# Altium schematic sheet Diagrama.SCHDOC
size A4; PageSetup: Record=PageOptions|CenterHorizontal=True|CenterVertical=True|PrintScale=0.97|XCorrection=1.00|YCorrection=1.00|PrintKind=0|BorderSize=5000000|LeftOffset=0|BottomOffset=0|Orientation=2|PaperLength=1000|PaperWidth=1000|Scale=100|PaperSource=7|PrintQuality=-4|MediaType=1|DitherType=10|PaperKind=A4|PrintScaleMode=1
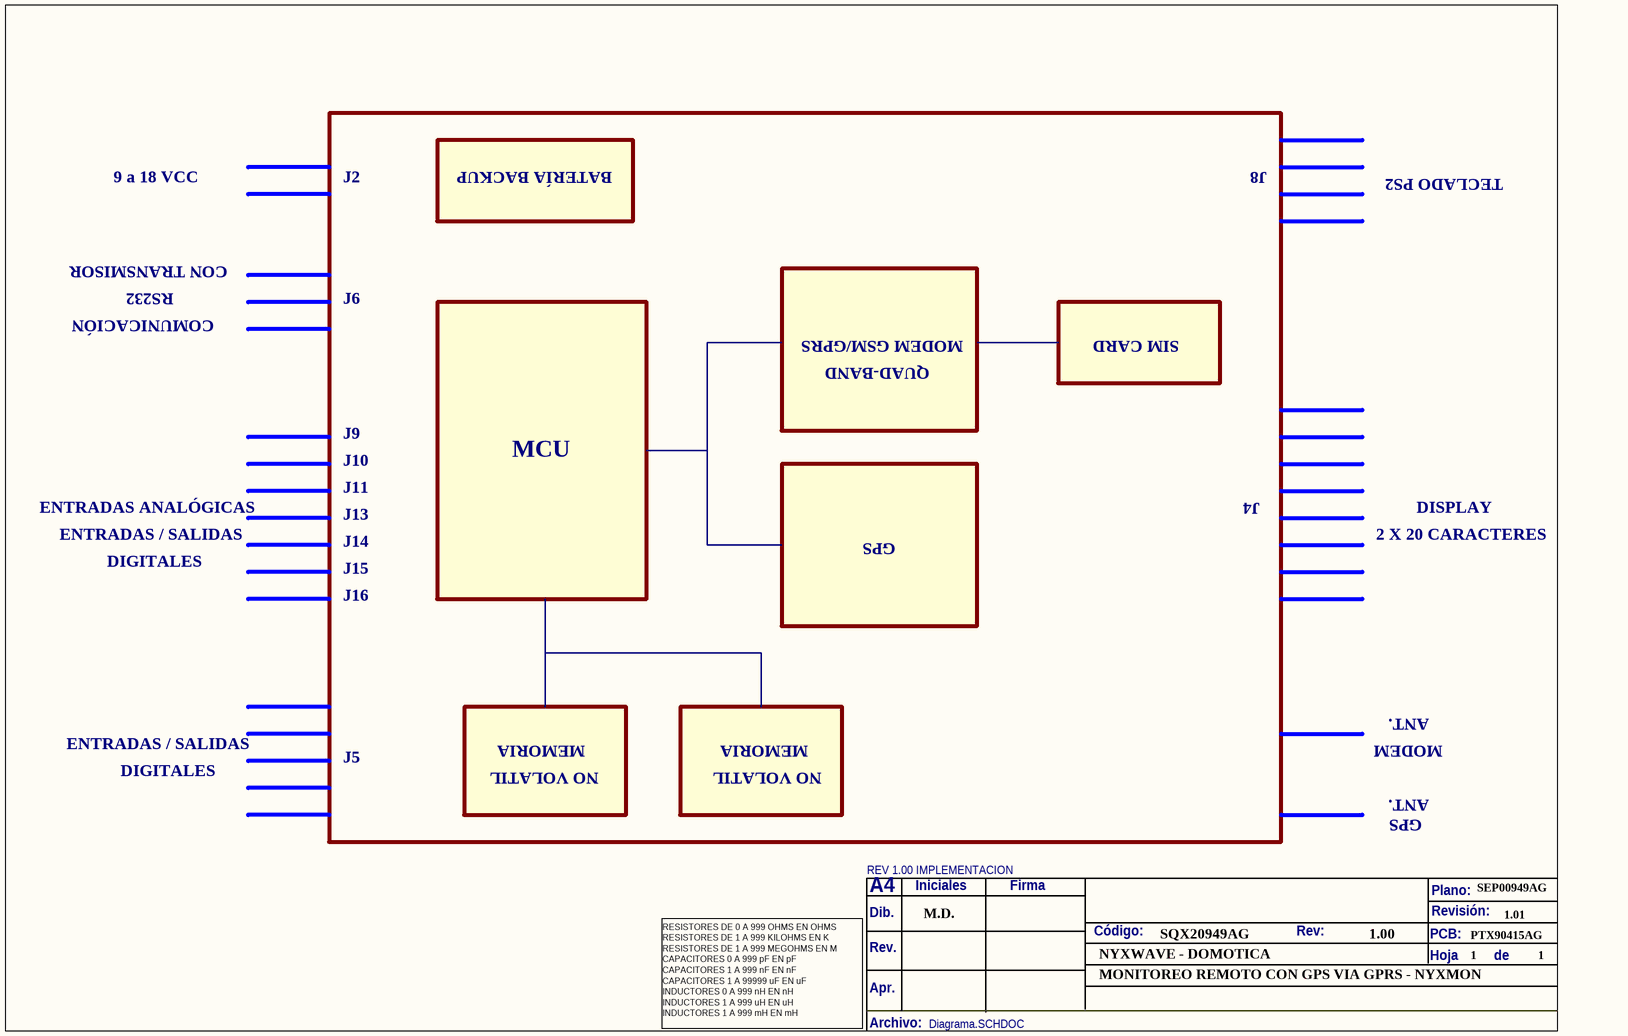
[diagram p0: Diagrama.SCHDOC]

## Notes on the sheet
- BATERÍA BACKUP
- J8
- TECLADO PS2
- 9 a 18 VCC
- J2
- RS232
- COMUNICACIÓN
- CON TRANSMISOR
- J6
- QUAD-BAND
- MODEM GSM/GPRS
- SIM CARD
- J9
- ENTRADAS ANALÓGICAS
- J10
- J11
- J13
- MCU
- J4
- DISPLAY
- ENTRADAS / SALIDAS
- DIGITALES
- J14
- J15
- GPS
- 2 X 20 CARACTERES
- J16
- ANT.
- J5
- MEMORIA
- NO VOLATIL
- MODEM
- Labels drawn without touching a wire or pin: 1, 1.00, M.D., MONITOREO REMOTO CON GPS VIA GPRS - NYXMON, NYXWAVE - DOMOTICA, PTX90415AG, SEP00949AG, SQX20949AG
- REV 1.00 IMPLEMENTACION
- Dib.
- A4
- Iniciales
- Firma
- Plano:
- Revisión:
- Rev.
- Código:
- Rev:
- Hoja          de
- PCB:
- RESISTORES DE 0 A 999 OHMS EN OHMS
  RESISTORES DE 1 A 999 KILOHMS EN K
  RESISTORES DE 1 A 999 MEGOHMS EN M
  CAPACITORES 0 A 999 pF EN pF
  CAPACITORES 1 A 999 nF EN nF
  CAPACITORES 1 A 99999 uF EN uF
  INDUCTORES 0 A 999 nH EN nH
  INDUCTORES 1 A 999 uH EN uH
  INDUCTORES 1 A 999 mH EN mH
- Apr.
- Archivo: